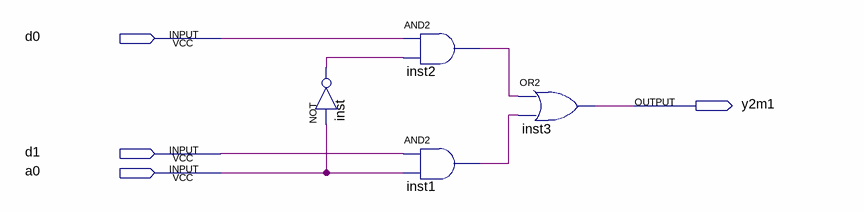
[diagram p0: schematic sheet]
// Quartus schematic mux2.bdf as structural Verilog: 4 symbols, 4 pins
module mux2 (
  input  d0,
  input  d1,
  input  a0,
  output y2m1
);

  wire inst1_out, inst2_out, inst_out;

  not inst (inst_out, a0);
  and inst2 (inst2_out, d0, inst_out);
  and inst1 (inst1_out, d1, a0);
  or inst3 (y2m1, inst2_out, inst1_out);
endmodule
